# EAGLE schematic Ultrasonic schem (EAGLE 9.5.2)
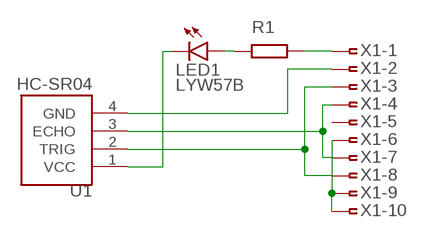
[diagram p0: schematic, sheet 1]

## Parts
LED1  LYW57B  [W57B]
R1  R  (no package)
U1  HC-SR04  [XCVR_HC-SR04]
X1  FSIDE-10  [FSIDE-10]

## Nets
N$1: R1.2 X1.1
N$2: LED1.A R1.1
N$3: LED1.C LED1.C@1(C) LED1.C@2(C) LED1.C@3(C) LED1.C@4(C) LED1.C@5(C) U1.1(VCC)
N$4: U1.4(GND) X1.2
N$5: U1.2(TRIG) X1.3 X1.8
N$6: U1.3(ECHO) X1.4 X1.7
N$7: X1.6 X1.9 X1.10
Unconnected: X1.5

## Library data of the parts
LED1 = led:*W57B: Golden Dragon® 1 Watt LED Place heat sink pads of cathode with INVOKE Source: www.osram-os.com la_ly_w57b.pdf
R1 = ngspice-simulation:R: RESISTOR
U1 = HC-SR04:HC-SR04: Ultrasonic Sensor Module; AVAILABILITY: Unavailable; DESCRIPTION: HC-SR04 Ultrasonic Sensor Platform Evaluation Expansion Board; MF: SparkFun Electronics; MP: HC-SR04; PACKAGE: None; PRICE: None
X1 = con-amp:FSIDE-10: AMP connector